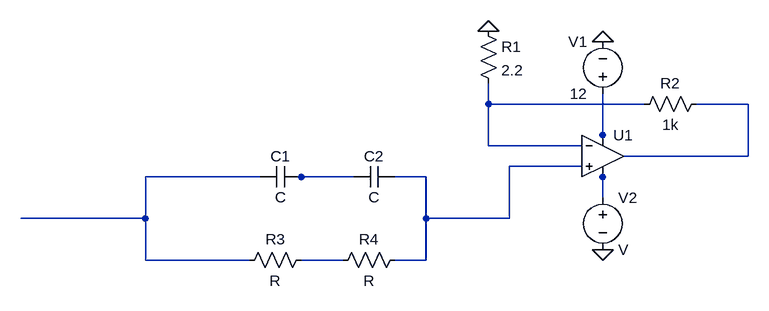
[diagram p0: schematic Draft1.asc]
Draft1.asc, the LTspice schematic file:
Version 4
SHEET 1 880 680
WIRE -16 80 -16 48
WIRE 224 80 -16 80
WIRE 384 80 304 80
WIRE 160 128 160 64
WIRE -16 144 -16 80
WIRE 128 144 -16 144
WIRE 160 144 160 128
WIRE 384 160 384 80
WIRE 384 160 192 160
WIRE 128 176 16 176
WIRE -368 192 -544 192
WIRE -304 192 -320 192
WIRE -224 192 -304 192
WIRE -112 192 -160 192
WIRE 160 192 160 176
WIRE 160 224 160 192
WIRE -544 256 -544 192
WIRE -544 256 -736 256
WIRE -112 256 -112 192
WIRE 16 256 16 176
WIRE 16 256 -112 256
WIRE -544 320 -544 256
WIRE -384 320 -544 320
WIRE -240 320 -304 320
WIRE -112 320 -112 256
WIRE -112 320 -160 320
FLAG 160 -16 0
FLAG 160 304 0
FLAG -16 -32 0
SYMBOL OpAmps\\UniversalOpamp2 160 160 R0
SYMATTR InstName U1
SYMBOL voltage 160 80 R180
WINDOW 0 24 96 Left 2
WINDOW 3 24 16 Left 2
WINDOW 123 0 0 Left 0
WINDOW 39 0 0 Left 0
SYMATTR InstName V1
SYMATTR Value 12
SYMBOL voltage 160 208 R0
SYMATTR InstName V2
SYMBOL res -32 -48 R0
SYMATTR InstName R1
SYMATTR Value 2.2
SYMBOL res 320 64 R90
WINDOW 0 0 56 VBottom 2
WINDOW 3 32 56 VTop 2
SYMATTR InstName R2
SYMATTR Value 1k
SYMBOL cap -304 176 R90
WINDOW 0 0 32 VBottom 2
WINDOW 3 32 32 VTop 2
SYMATTR InstName C1
SYMBOL cap -160 176 R90
WINDOW 0 0 32 VBottom 2
WINDOW 3 32 32 VTop 2
SYMATTR InstName C2
SYMBOL res -288 304 R90
WINDOW 0 0 56 VBottom 2
WINDOW 3 32 56 VTop 2
SYMATTR InstName R3
SYMBOL res -144 304 R90
WINDOW 0 0 56 VBottom 2
WINDOW 3 32 56 VTop 2
SYMATTR InstName R4

The netlist it stands for:
* Draft1.asc
XU1 N004 N001 N003 N007 N002 level.2 Avol=1Meg GBW=10Meg Slew=10Meg ilimit=25m rail=0 Vos=0 phimargin=45 en=0 enk=0 in=0 ink=0 Rin=500Meg  ; pins IN+ IN- V+ V- OUT
V1 N003 0 12
V2 N007 0 V
R1 0 N001 2.2
R2 N002 N001 1k
C1 N006 N005 C
C2 N004 N006 C
R3 N008 N005 R
R4 N004 N008 R
.lib UniversalOpamps2.sub
.backanno
.end